# Altium project fpga_board.PrjPcb (part 1 of 2)
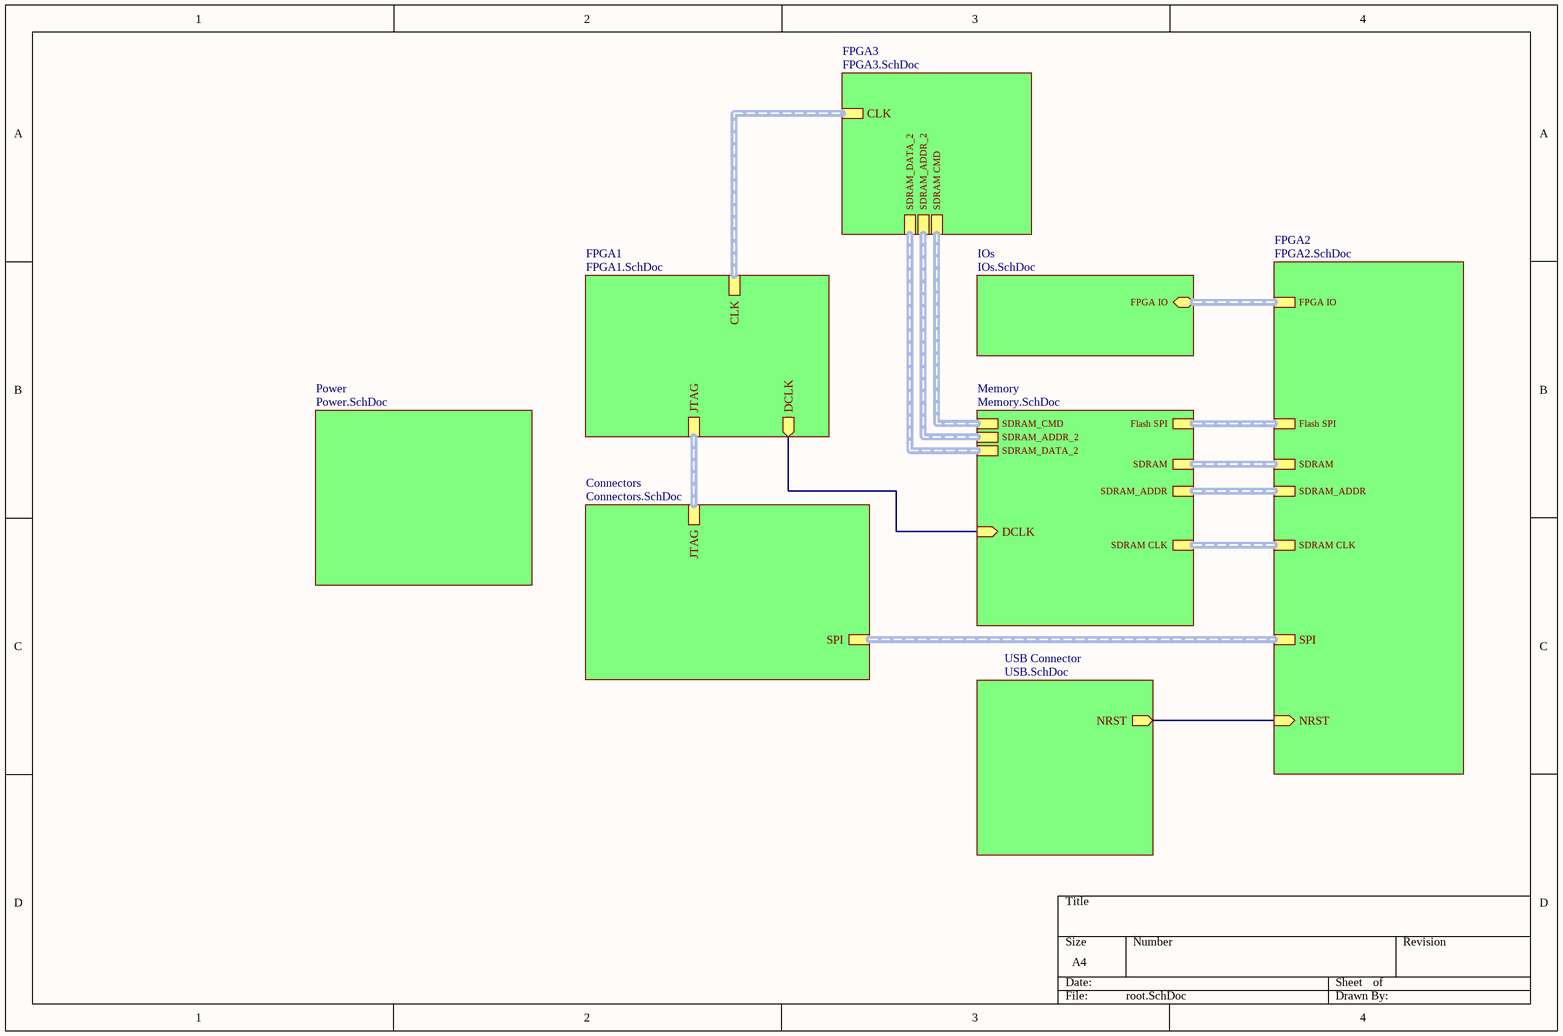
[diagram p0: root.SchDoc]
9 sheets, 192 parts. Net scope: hierarchical (ports join the sheet entries above them; power ports are global).
Board file: fpga_board.PcbDoc
Sheets:
  root.SchDoc
    FPGA1 = FPGA1.SchDoc
    IOs = IOs.SchDoc
    Memory = Memory.SchDoc
    Connectors = Connectors.SchDoc
    USB Connector = USB.SchDoc
    FPGA2 = FPGA2.SchDoc
    FPGA3 = FPGA3.SchDoc
    Power = Power.SchDoc

## Sheet root.SchDoc
size A4; SheetNumber: 1; SheetTotal: 9

### Sub-sheets
Connectors = Connectors.SchDoc: JTAG, SPI
FPGA1 = FPGA1.SchDoc: CLK, JTAG, DCLK (out)
FPGA2 = FPGA2.SchDoc: FPGA IO, Flash SPI, SDRAM, SDRAM_ADDR, SDRAM CLK, SPI, NRST (in)
FPGA3 = FPGA3.SchDoc: CLK, SDRAM CMD, SDRAM_ADDR_2, SDRAM_DATA_2
IOs = IOs.SchDoc: FPGA IO (bidir)
Memory = Memory.SchDoc: Flash SPI, SDRAM, SDRAM_ADDR, SDRAM_CMD, SDRAM CLK, DCLK (in), SDRAM_ADDR_2, SDRAM_DATA_2
Power = Power.SchDoc: no entries
USB Connector = USB.SchDoc: NRST (out)

### Nets
DCLK: sheet FPGA1/DCLK, sheet Memory/DCLK
(unnamed): sheet USB Connector/NRST, sheet FPGA2/NRST

### Buses and harness runs
harness sheet Connectors/JTAG = sheet FPGA1/JTAG
harness sheet Connectors/SPI = sheet FPGA2/SPI
harness sheet FPGA1/CLK = sheet FPGA3/CLK
harness sheet FPGA2/Flash SPI = sheet Memory/Flash SPI
harness sheet FPGA2/FPGA IO = sheet IOs/FPGA IO
harness sheet FPGA2/SDRAM = sheet Memory/SDRAM
harness sheet FPGA2/SDRAM CLK = sheet Memory/SDRAM CLK
harness sheet FPGA2/SDRAM_ADDR = sheet Memory/SDRAM_ADDR
harness sheet FPGA3/SDRAM CMD = sheet Memory/SDRAM_CMD
harness sheet FPGA3/SDRAM_ADDR_2 = sheet Memory/SDRAM_ADDR_2
harness sheet FPGA3/SDRAM_DATA_2 = sheet Memory/SDRAM_DATA_2

## Sheet FPGA1.SchDoc
size A4; SheetNumber: 2; SheetTotal: 9
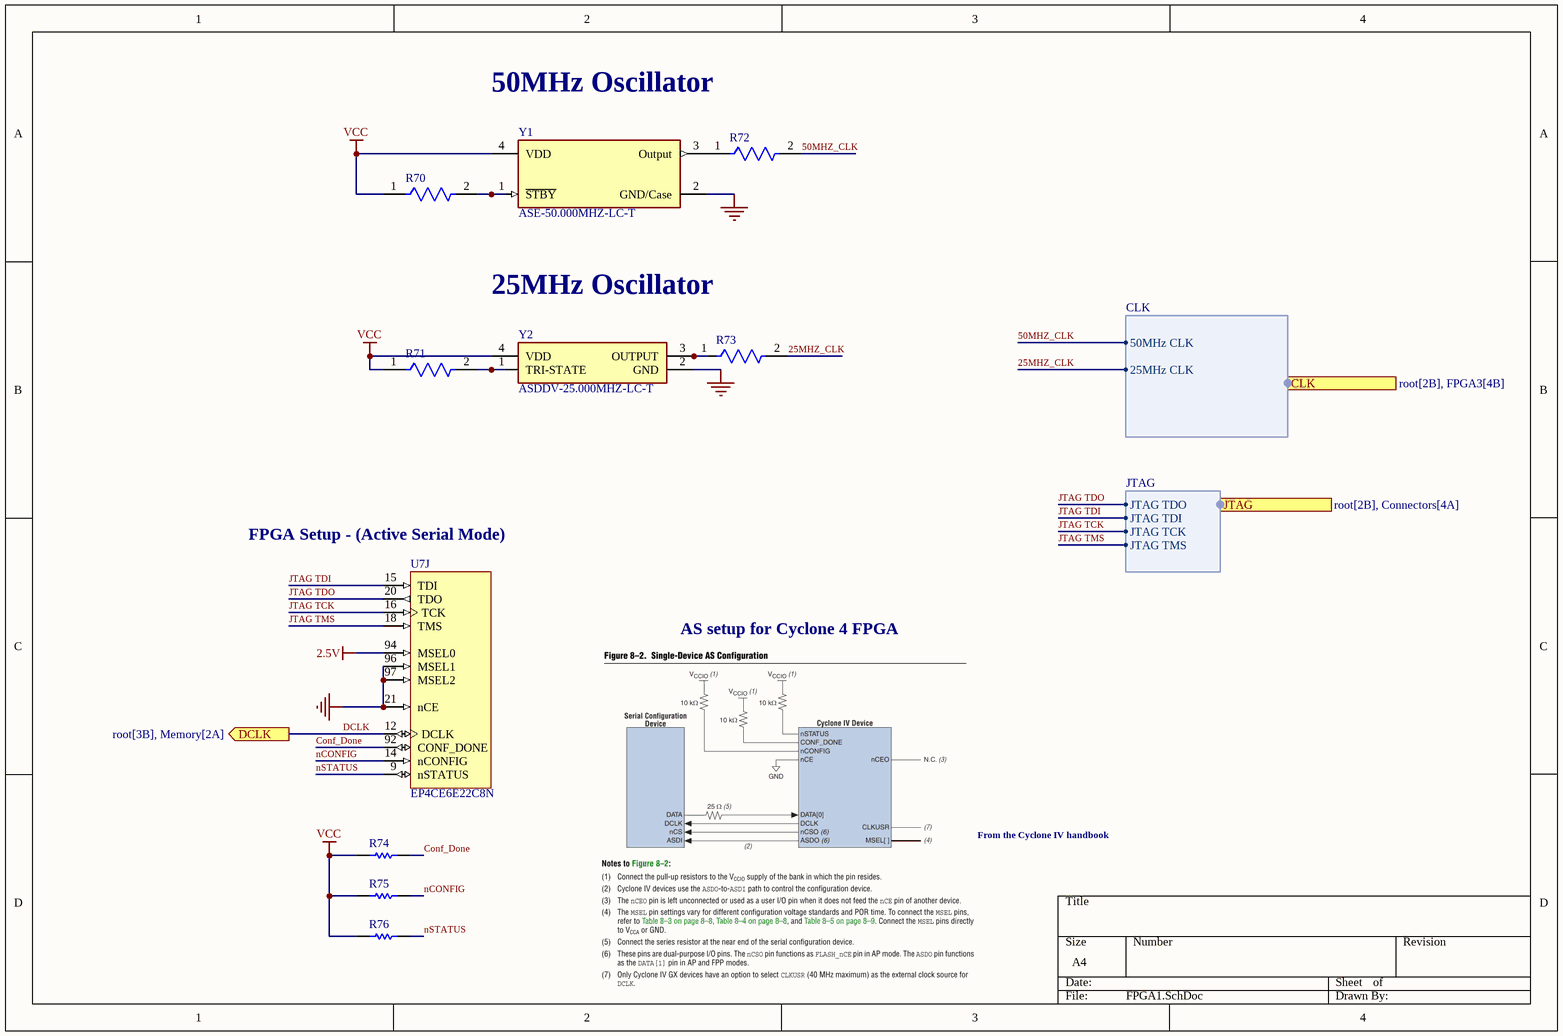
[diagram p1: FPGA1.SchDoc]

### Parts
R70  RC0603FR-073K3L  [FP-RC0603-0_55-MFG]  (value not drawn)
R71  RC0603FR-073K3L  [FP-RC0603-0_55-MFG]  (value not drawn)
R72  RT0402BRE0733RL  [FP-RT0402-MFG]  (value not drawn)
R73  RT0402BRE0733RL  [FP-RT0402-MFG]  (value not drawn)
R74  RC0402FR-0710KL  [RESC1005X40X25LL05T10]  (value not drawn)
R75  RC0402FR-0710KL  [RESC1005X40X25LL05T10]  (value not drawn)
R76  RC0402FR-0710KL  [RESC1005X40X25LL05T10]  (value not drawn)
U7  EP4CE6E22C8N  [EQFP144_A-165_D2-54_M]  (part J of 13)
Y1  ASE-50.000MHZ-LC-T  [FP-ASE-MFG]
Y2  ASDDV-25.000MHZ-LC-T  [AbraconASDDV]

### Ports
CLK (harness CLK, see root[2B], FPGA3[4B]), DCLK (out, see root[3B], Memory[2A]), JTAG (harness JTAG, see root[2B], Connectors[4A])

### Harnesses
CLK: 50MHz CLK, 25MHz CLK
JTAG: JTAG TDO, JTAG TDI, JTAG TCK, JTAG TMS

### Nets
2.5V: U7.94(MSEL0)
GND: U7.21(nCE) U7.96(MSEL1) U7.97(MSEL2) Y1.2(GND/Case) Y2.2(GND)
VCC: R70.1 R71.1 R74.1 R75.1 R76.1 Y1.4(VDD) Y2.4(VDD)
25MHZ_CLK: R73.2 ; port CLK.25MHz CLK  [project net 25MHz CLK]
50MHZ_CLK: R72.2 ; port CLK.50MHz CLK
Conf_Done: R74.2 U7.92(CONF_DONE)
DCLK: U7.12(DCLK) ; port DCLK
JTAG TCK: U7.16(TCK) ; port JTAG.JTAG TCK
JTAG TDI: U7.15(TDI) ; port JTAG.JTAG TDI
JTAG TDO: U7.20(TDO) ; port JTAG.JTAG TDO
JTAG TMS: U7.18(TMS) ; port JTAG.JTAG TMS
nCONFIG: R75.2 U7.14(nCONFIG)
nSTATUS: R76.2 U7.9(nSTATUS)
NetR70_2: R70.2 Y1.1(~{STBY})
NetR71_2: R71.2 Y2.1(TRI-STATE)
NetR72_1: R72.1 Y1.3(Output)
NetR73_1: R73.1 Y2.3(OUTPUT)

### Notes on the sheet
- 50MHz Oscillator
- 25MHz Oscillator
- (near U7) FPGA Setup - (Active Serial Mode)
- AS setup for Cyclone 4 FPGA
- From the Cyclone IV handbook

### Library data of the parts
R70 R71 = CMP-1012-00567-3: NexarPartId: 40011875; Tolerance: 1%; Power Rating: 100mW; Temperature Coefficient: 100ppm/°C; Voltage Rating (DC): 50V; Resistance: 3.3kΩ; Military Standard: Not; Case/Package: 0603; Mount: Surface Mount; Lead Free: Lead Free; Packaging: Tape & Reel; Termination: SMD/SMT; Number of Terminations: 2; Composition: Thick Film; Length: 1.6mm; Max Power Dissipation: 100mW; Width: 800µm; Features: Moisture Resistant; Max Operating Temperature: 155°C; Depth: 800µm; Number of Pins: 2; REACH SVHC: No SVHC; Case Code (Imperial): 0603; Case Code (Metric): 0603; RoHS: Compliant; Voltage Rating (AC): 50V; Voltage Rating: 50V; Schedule B: 8533210045, 8533210045; Min Operating Temperature: -55°C; Height: 450µm
R72 R73 = CMP-2002-02979-2: RES SMD 33 OHM 0.1% 1/16W 0402; Manufacturer: Yageo; Power Rating: 0.063W; Temperature Coefficient: 50 ppm/°C; Tolerance: 0.001; Resistance: 33Ω; Value: 33Ω; Voltage Rating: 50V; Lead Free: Yes; Temperature Range Low: -55°C; ComponentLink2Description: Datasheet; Device Class L2: Resistors; Footprint Url: http://www.yageo.com/exep/pages/download/literatures/PYu-R_Mount_10.pdf; Temperature: -55°C to +155°C; Automotive: No; Manufacturer Part Number: RT0402BRE0733RL; Series: RT; Device Class L3: Chip SMD Resistors; Height: 0.35mm; Digikey Description: RES SMD 33 OHM 0.1% 1/16W 0402; Octopart: https://octopart.com/rt0402bre0733rl-yageo-1202878; Package: RT0402; ComponentLink2URL: http://www.yageo.com/documents/recent/PYu-RT_1-to-0.01_RoHS_L_9.pdf; Composition: Thin Film; Category: Res; Ipc Land Pattern Name: RESC10050X30; Device Class L1: Passive Components; RoHS: TRUE; Temperature Range High: +155°C
R74-R76 = CMP-2002-07353-1: Manufacturer: Yageo / Phycomp; Part Number: RC0402FR-0710KL
U7 = CMP-0038-00212-1: Cyclone IV Family FPGA, 1.2V Core, 91 I/O Pins, 2 PLLs, 144-Pin QFP, Speed Grade 8, Commercial Grade, Pb-Free; Manufacturer: Altera; ComponentLink3Description: Pinout; ComponentLink4Description: Package Specification; DatasheetVersion: ver1.6, Nov-2011; ComponentLink1URL: http://www.altera.com/; ComponentLink2URL: http://www.altera.com/literature/hb/cyclone-iv/cyclone4-handbook.pdf; ComponentLink2Description: Handbook; PackageReference: EQFP144_A-165_D2-54; ComponentLink3URL: http://www.altera.com/literature/lit-dp.jsp?category=cyc%204&showspreadsheet=y; PackageVersion: ver1.0, Jan-2011; ComponentLink1Description: Manufacturer URL; ComponentLink4URL: http://www.altera.com/devicepackaging/04R00402-00.pdf; PackageDescription: 144-Pin Plastic Enhanced Quad Flat Pack (EQFP) - Wire Bond - A:1.65 - D2:5.4; Code_JEDEC: MS-026-BFB-HD
Y1 = CMP-27762-009764-1: XTAL Oscillator 50MHz ±50ppm CMOS 3.3V 4-SMD 3.2mm x 2.5mm; Load Capacitance: 15pF; Max Supply Current: 19mA; Min Supply Voltage: 3.135V; Max Supply Voltage: 3.465V; Packaging: Tape and Reel; Height: 0.047inch; Mount: Surface Mount; Frequency Stability: 50ppm; Lead Free: Lead Free; Number of Pins: 4; Width: 0.098inch; Radiation Hardening: No; Max Operating Temperature: 85°C; Length: 3.2mm; REACH SVHC: No SVHC; Series: ASE; Depth: 2.5mm; Operating Supply Voltage: 3.3V; Min Operating Temperature: -40°C; Package Quantity: 1000; Operating Frequency: 50 MHz; Case/Package: SMD/SMT; Termination: SMD/SMT; Frequency: 50MHz
Y2 = ASDDV-25.000MHZ-LC-T: Crystal or Oscillator; Manufacturer_Name: ABRACON; Datasheet Link: https://abracon.com/datasheets/ASDDV.pdf; Height: 0.95mm; Manufacturer_Part_Number: ASDDV-25.000MHZ-LC-T; Mouser Part Number: 815-ASDDV-2500MHZLCT; Mouser Price/Stock: https://www.mouser.co.uk/ProductDetail/ABRACON/ASDDV-25.000MHZ-LC-T?qs=GedFDFLaBXGr7Q4o6E2H1w%3D%3D; Arrow Part Number: ASDDV-25.000MHZ-LC-T; Arrow Price/Stock: https://www.arrow.com/en/products/asddv-25.000mhz-lc-t/abracon?region=nac

## Sheet IOs.SchDoc
size A4; SheetNumber: 3; SheetTotal: 9
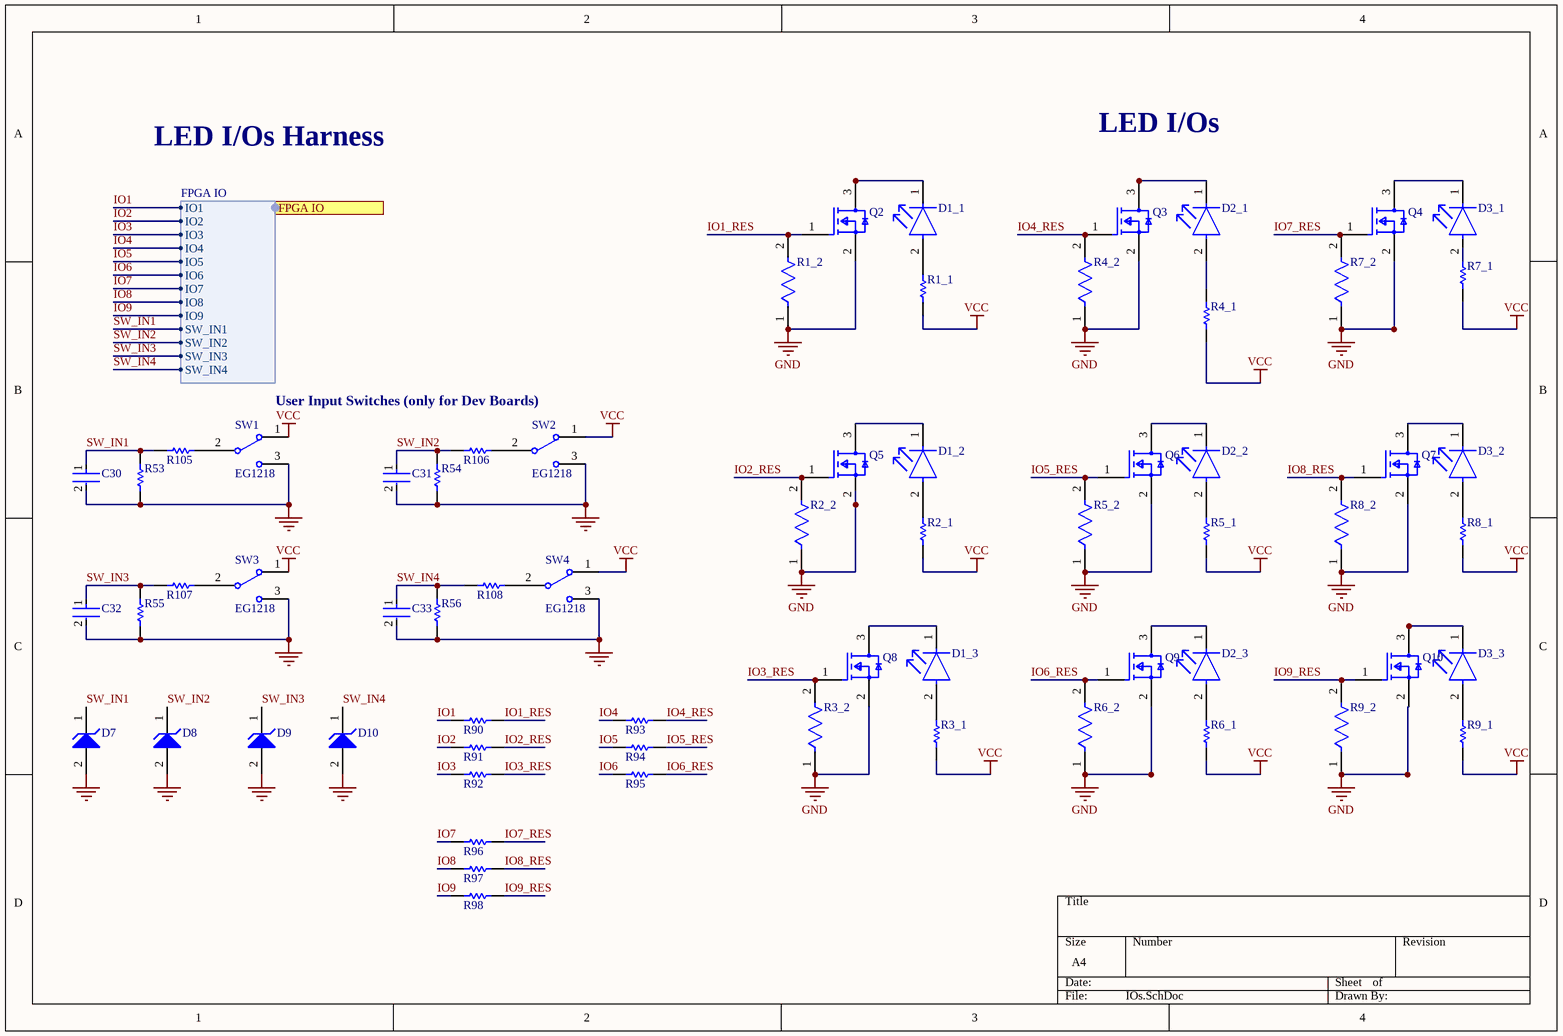
[diagram p2: IOs.SchDoc]

### Parts
C30  CC0402KRX7R9BB103  [FP-CC0402-MFG]  (value not drawn)
C31  CC0402KRX7R9BB103  [FP-CC0402-MFG]  (value not drawn)
C32  CC0402KRX7R9BB103  [FP-CC0402-MFG]  (value not drawn)
C33  CC0402KRX7R9BB103  [FP-CC0402-MFG]  (value not drawn)
D1_1  LTST-C230KRKT  [FP-LTST-C230KRKT-MFG]  (value not drawn)
D1_2  LTST-C230KRKT  [FP-LTST-C230KRKT-MFG]  (value not drawn)
D1_3  LTST-C230KRKT  [FP-LTST-C230KRKT-MFG]  (value not drawn)
D2_1  LTST-C230KRKT  [FP-LTST-C230KRKT-MFG]  (value not drawn)
D2_2  LTST-C230KRKT  [FP-LTST-C230KRKT-MFG]  (value not drawn)
D2_3  LTST-C230KRKT  [FP-LTST-C230KRKT-MFG]  (value not drawn)
D3_1  LTST-C230KRKT  [FP-LTST-C230KRKT-MFG]  (value not drawn)
D3_2  LTST-C230KRKT  [FP-LTST-C230KRKT-MFG]  (value not drawn)
D3_3  LTST-C230KRKT  [FP-LTST-C230KRKT-MFG]  (value not drawn)
D7  MM5Z3V3T1G  [ONSC-SOD-523-2-502-01_V]  (value not drawn)
D8  MM5Z3V3T1G  [ONSC-SOD-523-2-502-01_V]  (value not drawn)
D9  MM5Z3V3T1G  [ONSC-SOD-523-2-502-01_V]  (value not drawn)
D10  MM5Z3V3T1G  [ONSC-SOD-523-2-502-01_V]  (value not drawn)
Q2  MMBF170LT1G  [FP-318-08-IPC_B]  (value not drawn)
Q3  MMBF170LT1G  [FP-318-08-IPC_B]  (value not drawn)
Q4  MMBF170LT1G  [FP-318-08-IPC_B]  (value not drawn)
Q5  MMBF170LT1G  [FP-318-08-IPC_B]  (value not drawn)
Q6  MMBF170LT1G  [FP-318-08-IPC_B]  (value not drawn)
Q7  MMBF170LT1G  [FP-318-08-IPC_B]  (value not drawn)
Q8  MMBF170LT1G  [FP-318-08-IPC_B]  (value not drawn)
Q9  MMBF170LT1G  [FP-318-08-IPC_B]  (value not drawn)
Q10  MMBF170LT1G  [FP-318-08-IPC_B]  (value not drawn)
R1_1  RC0402FR-07330RL  [RESC1005X40X25LL05T10]  (value not drawn)
R1_2  RC0402JR-0710KL  [FP-RC0402-0_4-IPC_C]  (value not drawn)
R2_1  RC0402FR-07330RL  [RESC1005X40X25LL05T10]  (value not drawn)
R2_2  RC0402JR-0710KL  [FP-RC0402-0_4-IPC_C]  (value not drawn)
R3_1  RC0402FR-07330RL  [RESC1005X40X25LL05T10]  (value not drawn)
R3_2  RC0402JR-0710KL  [FP-RC0402-0_4-IPC_C]  (value not drawn)
R4_1  RC0402FR-07330RL  [RESC1005X40X25LL05T10]  (value not drawn)
R4_2  RC0402JR-0710KL  [FP-RC0402-0_4-IPC_C]  (value not drawn)
R5_1  RC0402FR-07330RL  [RESC1005X40X25LL05T10]  (value not drawn)
R5_2  RC0402JR-0710KL  [FP-RC0402-0_4-IPC_C]  (value not drawn)
R6_1  RC0402FR-07330RL  [RESC1005X40X25LL05T10]  (value not drawn)
R6_2  RC0402JR-0710KL  [FP-RC0402-0_4-IPC_C]  (value not drawn)
R7_1  RC0402FR-07330RL  [RESC1005X40X25LL05T10]  (value not drawn)
R7_2  RC0402JR-0710KL  [FP-RC0402-0_4-IPC_C]  (value not drawn)
R8_1  RC0402FR-07330RL  [RESC1005X40X25LL05T10]  (value not drawn)
R8_2  RC0402JR-0710KL  [FP-RC0402-0_4-IPC_C]  (value not drawn)
R9_1  RC0402FR-07330RL  [RESC1005X40X25LL05T10]  (value not drawn)
R9_2  RC0402JR-0710KL  [FP-RC0402-0_4-IPC_C]  (value not drawn)
R53  3K3 5% 0603(1608)  [RESC0603(1608)_N]  (value not drawn)
R54  3K3 5% 0603(1608)  [RESC0603(1608)_N]  (value not drawn)
R55  3K3 5% 0603(1608)  [RESC0603(1608)_N]  (value not drawn)
R56  3K3 5% 0603(1608)  [RESC0603(1608)_N]  (value not drawn)
R90  RC0402FR-07330RL  [RESC1005X40X25LL05T10]  (value not drawn)
R91  RC0402FR-07330RL  [RESC1005X40X25LL05T10]  (value not drawn)
R92  RC0402FR-07330RL  [RESC1005X40X25LL05T10]  (value not drawn)
R93  RC0402FR-07330RL  [RESC1005X40X25LL05T10]  (value not drawn)
R94  RC0402FR-07330RL  [RESC1005X40X25LL05T10]  (value not drawn)
R95  RC0402FR-07330RL  [RESC1005X40X25LL05T10]  (value not drawn)
R96  RC0402FR-07330RL  [RESC1005X40X25LL05T10]  (value not drawn)
R97  RC0402FR-07330RL  [RESC1005X40X25LL05T10]  (value not drawn)
R98  RC0402FR-07330RL  [RESC1005X40X25LL05T10]  (value not drawn)
R105  RC0402FR-07330RL  [RESC1005X40X25LL05T10]  (value not drawn)
R106  RC0402FR-07330RL  [RESC1005X40X25LL05T10]  (value not drawn)
R107  RC0402FR-07330RL  [RESC1005X40X25LL05T10]  (value not drawn)
R108  RC0402FR-07330RL  [RESC1005X40X25LL05T10]  (value not drawn)
SW1  EG1218  [ESWI-EG1218_V]
SW2  EG1218  [ESWI-EG1218_V]
SW3  EG1218  [ESWI-EG1218_V]
SW4  EG1218  [ESWI-EG1218_V]

### Ports
FPGA IO (harness FPGA IO, see root[4B], FPGA2[3A])

### Harnesses
FPGA IO: IO1, IO2, IO3, IO4, IO5, IO6, IO7, IO8, IO9, SW_IN1, SW_IN2, SW_IN3, SW_IN4

### Nets
GND: C30.2 C31.2 C32.2 C33.2 D7.2(A) D8.2(A) D9.2(A) D10.2(A) Q2.2(S) Q3.2(S) Q4.2(S) Q5.2(S) Q6.2(S) Q7.2(S) Q8.2(S) Q9.2(S) Q10.2(S) R1_2.1 R2_2.1 R3_2.1 R4_2.1 R5_2.1 R6_2.1 R7_2.1 R8_2.1 R9_2.1 R53.1 R54.1 R55.1 R56.1 SW1.3 SW2.3 SW3.3 SW4.3
VCC: R1_1.1 R2_1.1 R3_1.1 R4_1.1 R5_1.1 R6_1.1 R7_1.1 R8_1.1 R9_1.1 SW1.1 SW2.1 SW3.1 SW4.1
IO1: R90.2 ; port FPGA IO.IO1
IO1_RES: Q2.1(G) R1_2.2 R90.1
IO2: R91.2 ; port FPGA IO.IO2
IO2_RES: Q5.1(G) R2_2.2 R91.1
IO3: R92.2 ; port FPGA IO.IO3
IO3_RES: Q8.1(G) R3_2.2 R92.1
IO4: R93.2 ; port FPGA IO.IO4
IO4_RES: Q3.1(G) R4_2.2 R93.1
IO5: R94.2 ; port FPGA IO.IO5
IO5_RES: Q6.1(G) R5_2.2 R94.1
IO6: R95.2 ; port FPGA IO.IO6
IO6_RES: Q9.1(G) R6_2.2 R95.1
IO7: R96.2 ; port FPGA IO.IO7
IO7_RES: Q4.1(G) R7_2.2 R96.1
IO8: R97.2 ; port FPGA IO.IO8
IO8_RES: Q7.1(G) R8_2.2 R97.1
IO9: R98.2 ; port FPGA IO.IO9
IO9_RES: Q10.1(G) R9_2.2 R98.1
SW_IN1: C30.1 D7.1(K) R53.2 R105.2 ; port FPGA IO.SW_IN1
SW_IN2: C31.1 D8.1(K) R54.2 R106.2 ; port FPGA IO.SW_IN2
SW_IN3: C32.1 D9.1(K) R55.2 R107.2 ; port FPGA IO.SW_IN3
SW_IN4: C33.1 D10.1(K) R56.2 R108.2 ; port FPGA IO.SW_IN4
NetD1_1_1: D1_1.1(C) Q2.3(D)
NetD1_1_2: D1_1.2(A) R1_1.2
NetD1_2_1: D1_2.1(C) Q5.3(D)
NetD1_2_2: D1_2.2(A) R2_1.2
NetD1_3_1: D1_3.1(C) Q8.3(D)
NetD1_3_2: D1_3.2(A) R3_1.2
NetD2_1_1: D2_1.1(C) Q3.3(D)
NetD2_1_2: D2_1.2(A) R4_1.2
NetD2_2_1: D2_2.1(C) Q6.3(D)
NetD2_2_2: D2_2.2(A) R5_1.2
NetD2_3_1: D2_3.1(C) Q9.3(D)
NetD2_3_2: D2_3.2(A) R6_1.2
NetD3_1_1: D3_1.1(C) Q4.3(D)
NetD3_1_2: D3_1.2(A) R7_1.2
NetD3_2_1: D3_2.1(C) Q7.3(D)
NetD3_2_2: D3_2.2(A) R8_1.2
NetD3_3_1: D3_3.1(C) Q10.3(D)
NetD3_3_2: D3_3.2(A) R9_1.2
NetR105_1: R105.1 SW1.2(COM)
NetR106_1: R106.1 SW2.2(COM)
NetR107_1: R107.1 SW3.2(COM)
NetR108_1: R108.1 SW4.2(COM)

### Notes on the sheet
- LED I/Os Harness
- LED I/Os
- User Input Switches (only for Dev Boards)

### Library data of the parts
C30-C33 = CMP-2100-03592-2: CAP CER 10000PF 50V X7R 0402; Manufacturer: YAGEO; Temperature Coefficient: 30ppm/°C; Capacitance: 10 nF; Material: Ceramic; Automotive Grade: NA; Tolerance: 0.1; Value: 10 nF; Device Class L3: Ceramic Capacitors; Temperature: -55°C to +125°C; Footprint Url: http://www.yageo.com/exep/pages/download/literatures/UPY-C_GEN_24.pdf; Ipc Land Pattern Name: CAPC10050X50; Device Class L1: Passive Components; Automotive: No; Octopart: https://octopart.com/cc0402krx7r9bb103-yageo-8376513; Manufacturer Part Number: CC0402KRX7R9BB103; Lead Free: Yes; Temperature Range Low: -55°C; Height: 0.55mm; ComponentLink2URL: http://www.yageo.com/documents/recent/UPY-GP_NP0_16V-to-50V_16.pdf; Category: Cap; ComponentLink2Description: Datasheet; Temperature Range High: +125°C; Digikey Description: CAP CER 10000PF 50V X7R 0402; Voltage Rating: 50 V; Package: CC0402; Device Class L2: Capacitors; Mouser Description: 0402 10 nF 50 V ±10 % Tolerance X7R SMT Multilayer Ceramic Capacitor; RoHS: TRUE; Temperature Characteristic: X7R
D1_1-D1_3 D2_1-D2_3 D3_1-D3_3 = CMP-22017-000041-1: LED RED CLEAR CHIP SMD; Dominant Wavelength: 631nm; Lens Color: Colorless; Lens Style: Diffused; Forward Voltage: 2V; Test Current: 20mA; Luminous Intensity: 54mcd; Number of LEDs: 1; Viewing Angle: 130°; Power Rating: 75mW; Forward Current: 30mA; Wavelength: 639nm; Reverse Voltage: 5V; Min Operating Temperature: -55°C; Height: 1.1mm; Length: 3.2mm; Lens Transparency: Clear; Case/Package: 1206; Package Quantity: 1; Width: 1.6mm; Max Operating Temperature: 85°C; Packaging: Tape and Reel; RoHS Compliant: Yes; Mount: Surface Mount; Lead Free: Lead Free; Depth: 1.6mm; Power Dissipation: 75mW; Number of Pins: 2; Number of Elements: 1; Color: Red; Illumination Color: Red; Case Code (Imperial): 1206; Case Code (Metric): 3216; Radiation Hardening: No
D7-D10 = CMP-1060-00750-1: Zener Voltage Regulator, 500 mW, 2-Pin SOD-523, Pb-Free, Tape and Reel; Manufacturer: On Semiconductor; P Max (W): 0.5; VZ Typ (V): 3.3; RoHS: Pb-Free; ComponentLink2Description: Datasheet; PackageReference: SOD-523-2-502-01; DatasheetVersion: Rev. 10; ComponentLink1Description: Manufacturer URL; PackageVersion: Rev. E, 09/2010; ComponentLink3URL: http://www.onsemi.com/pub_link/Collateral/502-01.PDF; ComponentLink2URL: http://www.onsemi.cn/pub_link/Collateral/MM5Z2V4T1-D.PDF; Mounting Technology: Surface Mount; PartNumber: MM5Z3V3T1G; Packing: Tape and Reel; PackageDescription: 2-Pin SOD, Body 1.2 x 0.8 mm; ComponentLink1URL: http://www.onsemi.com/; ComponentLink3Description: Package Specification
Q2-Q10 = CMP-1058-00793-2: MOSFET N-CH 60V 500MA SOT-23; Polarization: N; Rds On Max: 5R; Power Dissipation: 225mW; Number of Elements: 1; Element Configuration: Single; Input Capacitance: 60pF; Threshold Voltage: 3V; Polarity: N-CHANNEL; Gate to Source Voltage (Vgs): 20V; Turn-Off Delay Time: 10ns; Drain to Source Breakdown Voltage: 60V; On-State Resistance: 5R; Width: 1.3mm; Voltage Rating (DC): 60V; Package Quantity: 3000; Max Operating Temperature: 150°C; Drain to Source Resistance: 5R; Drain-source On Resistance-Max: 5R; Packaging: Tape and Reel; REACH SVHC: No SVHC; Case/Package: SOT-23-3; Number of Pins: 3; RoHS Compliant: Yes; Radiation Hardening: No; Min Operating Temperature: -55°C; Continuous Drain Current (ID): 500mA; Lead Free: Lead Free; Height: 0.94mm; Current Rating: 500mA; Turn-On Delay Time: 10ns; Series: -; Max Power Dissipation: 225mW; Length: 2.9mm; Nominal Vgs: 3V
R1_1 R2_1 R3_1 R4_1 R5_1 R6_1 R7_1 R8_1 R9_1 R90-R98 R105-R108 = CMP-2002-07613-1: Manufacturer: Yageo / Phycomp; Part Number: RC0402FR-07330RL
R1_2 R2_2 R3_2 R4_2 R5_2 R6_2 R7_2 R8_2 R9_2 = CMP-2002-07915-3: RES 10K OHM 5% 1/16W 0402; Max Power Dissipation: 63mW; Temperature Coefficient: 100ppm/°C; Power Rating: 62.5mW; Resistance: 10kR; Voltage Rating: 50V; Size Code: 0402; Resistance Tolerance: 5%; Packaging: Tape and Reel; Case Code (Metric): 1005; Lead Free: Lead Free; Resistor Type: Thick Film; Min Operating Temperature: -55°C; Military Standard: Not; Depth: 0.5mm; Series: RC; Case/Package: 0402; Construction: Rectangular; Number of Terminations: 2; Package Quantity: 1; Termination: SMD/SMT; Length: 0.039inch; Case Code (Imperial): 0402; Height: 0.016inch; Features: Moisture Resistant; RoHS Compliant: Yes; Max Operating Temperature: 155°C; Tolerance: 5%; Width: 0.02inch
R53-R56 = CMP-1012-00086-1: 3K3 0.1W 5% 0603 (1608 Metric)  SMD; Case-EIA: 0603; Value: 3300.00 Ohm; Case-Metric: 1608; Technology: SMT; Tolerance: 5 %; Power: 0.1 W
SW1-SW4 = CMP-1696-00002-1: Slide Switch, 500 V, -20 to 70 degC, 3-Pin THD, RoHS; Case\Package: SOT-23-5; Output Current: 150 mA; Nominal Output Voltage: 3.3 V; Max Power Dissipation: 250 mW; Min Input Voltage: 4.3 V; Outputs: 1; Max Input Voltage: 8 V; Dropout Voltage: 300 mV; PackageDescription: 3-Pin Through Hole Device, Body 11.6 x 4 mm, Pitch 2.5 mm; ComponentLink1URL: http://www.e-switch.ch/en/; RoHSCompliant: true; Length: 3 mm; ComponentLink1Description: Manufacturer URL; Power Rating: 250 mW; Mount: Surface Mount; Max Operating Temperature: 85 degC; REACH SVHC: No SVHC; Radiation Hardening: No; Height: 1.3 mm; Pins: 5; Max Ouput Current: 150 mA; Output Voltage: 3.3 V; Width: 1.8 mm; Package Quantity: 3000; ComponentLink2URL: https://www.e-switch.com/system/asset/product_line/data_sheet/119/EG.pdf; Min Operating Temperature: -40 degC; ComponentLink2Description: Datasheet; DatasheetVersion: Oct-15; PackageReference: EG1218; Packaging: Tape and Reel

## Sheet Memory.SchDoc
size A4; SheetNumber: 5; SheetTotal: 9
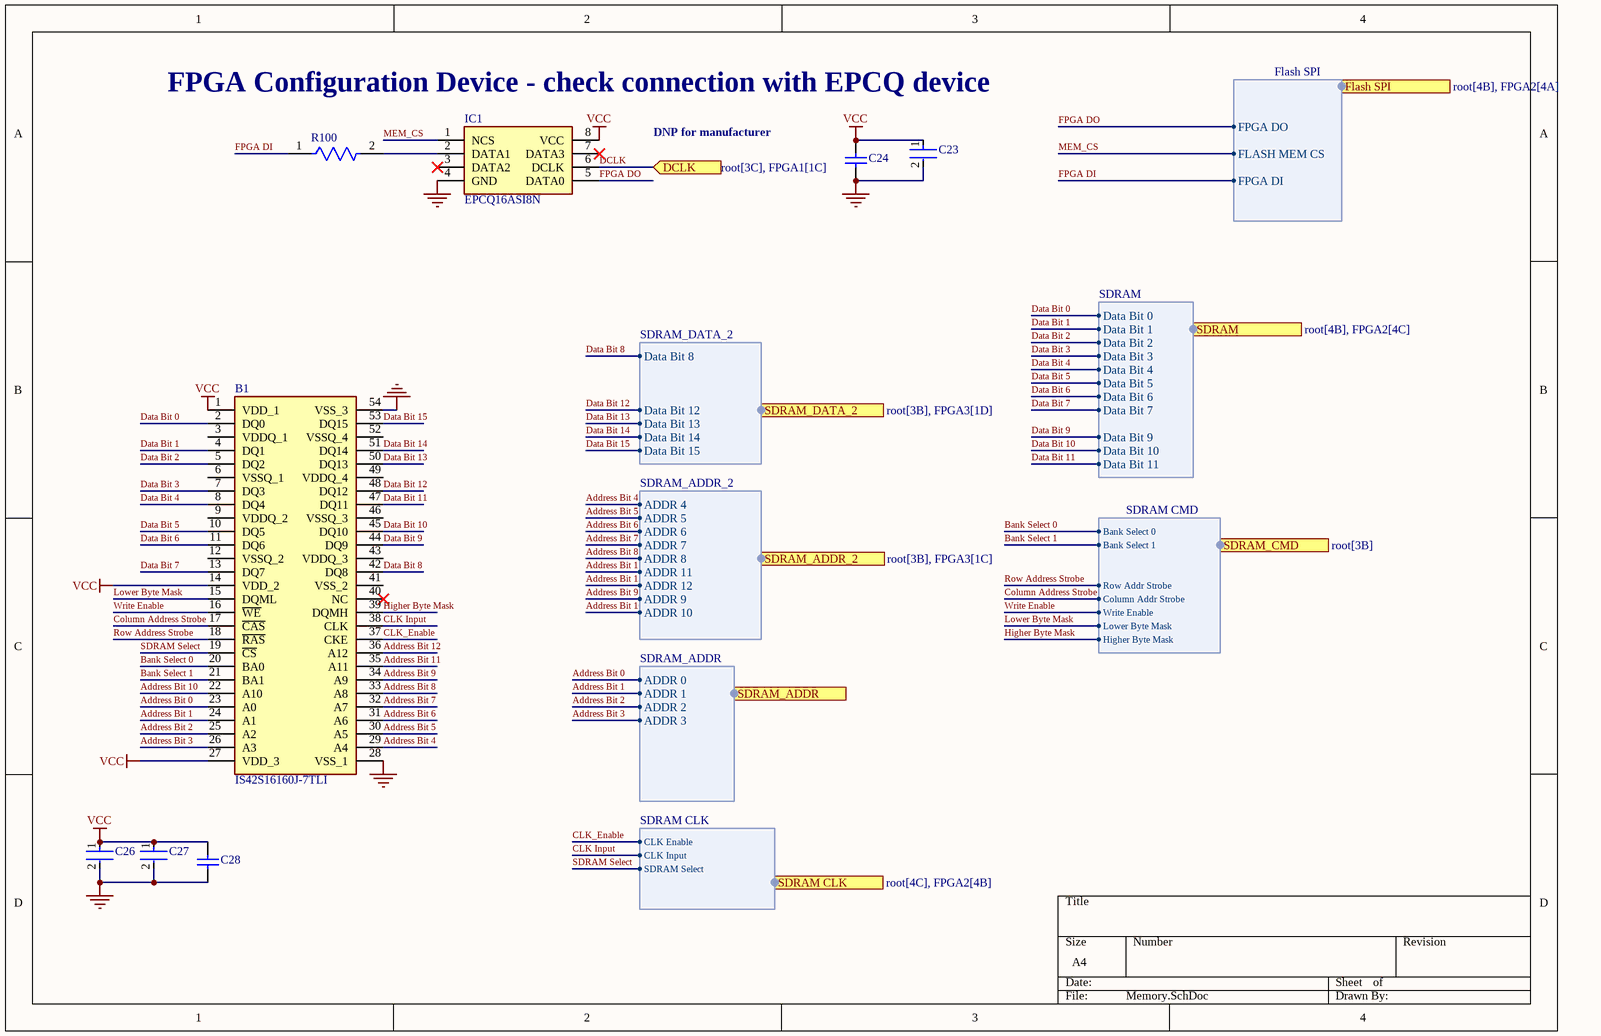
[diagram p3: Memory.SchDoc]

### Parts
B1  IS42S16160J-7TLI  [SOP80P1176X120-54N]
C23  CC0402KRX7R7BB104  [FP-CC0402-MFG]  (value not drawn)
C24  C0603C105K9PACTU  [CAPC1608X90X35LL15T15]  (value not drawn)
C26  CC0603KRX7R9BB104  [FP-CC0603-DA-MFG]  (value not drawn)
C27  CL21A475KAQNNNE  [FP-CL21-IPC_A]  (value not drawn)
C28  C0603C105K9PACTU  [CAPC1608X90X35LL15T15]  (value not drawn)
IC1  EPCQ16ASI8N  [SOIC127P600X175-8N]
R100  RC0402JR-0722RL  [FP-RC0402-0_4-IPC_B]  (value not drawn)

### Ports
DCLK (in, see root[3C], FPGA1[1C]), Flash SPI (harness Flash SPI, see root[4B], FPGA2[4A]), SDRAM (harness SDRAM, see root[4B], FPGA2[4C]), SDRAM CLK (harness SDRAM CLK, see root[4C], FPGA2[4B]), SDRAM_ADDR (harness SDRAM_ADDR, see root[4B], FPGA2[4C]), SDRAM_ADDR_2 (harness SDRAM_ADDR_2, see root[3B], FPGA3[1C]), SDRAM_CMD (harness SDRAM CMD, see root[3B]), SDRAM_DATA_2 (harness SDRAM_DATA_2, see root[3B], FPGA3[1D])

### Harnesses
Flash SPI: FPGA DO, FLASH MEM CS, FPGA DI
SDRAM: Data Bit 0, Data Bit 1, Data Bit 2, Data Bit 3, Data Bit 4, Data Bit 5, Data Bit 6, Data Bit 7, Data Bit 9, Data Bit 10, Data Bit 11
SDRAM_ADDR: ADDR 0, ADDR 1, ADDR 2, ADDR 3
SDRAM CMD: Bank Select 0, Bank Select 1, Row Addr Strobe, Column Addr Strobe, Write Enable, Lower Byte Mask, Higher Byte Mask
SDRAM CLK: CLK Enable, CLK Input, SDRAM Select
SDRAM_ADDR_2: ADDR 4, ADDR 5, ADDR 6, ADDR 7, ADDR 8, ADDR 11, ADDR 12, ADDR 9, ADDR 10
SDRAM_DATA_2: Data Bit 12, Data Bit 13, Data Bit 14, Data Bit 15, Data Bit 8

### Nets
GND: B1.28(VSS_1) B1.54(VSS_3) C23.2 C24.1 C26.2 C27.2 C28.1 IC1.4(GND)
VCC: B1.1(VDD_1) B1.14(VDD_2) B1.27(VDD_3) C23.1 C24.2 C26.1 C27.1 C28.2 IC1.8(VCC)
Address Bit 0: B1.23(A0) ; port SDRAM_ADDR.ADDR 0  [project net Addr Bit 0]
Address Bit 1: B1.24(A1) ; port SDRAM_ADDR.ADDR 1  [project net Addr Bit 1]
Address Bit 2: B1.25(A2) ; port SDRAM_ADDR.ADDR 2  [project net Addr Bit 2]
Address Bit 3: B1.26(A3) ; port SDRAM_ADDR.ADDR 3  [project net Addr Bit 3]
Address Bit 4: B1.29(A4) ; port SDRAM_ADDR_2.ADDR 4
Address Bit 5: B1.30(A5) ; port SDRAM_ADDR_2.ADDR 5
Address Bit 6: B1.31(A6) ; port SDRAM_ADDR_2.ADDR 6
Address Bit 7: B1.32(A7) ; port SDRAM_ADDR_2.ADDR 7
Address Bit 8: B1.33(A8) ; port SDRAM_ADDR_2.ADDR 8
Address Bit 9: B1.34(A9) ; port SDRAM_ADDR_2.ADDR 9  [project net Addr Bit 9]
Address Bit 10: B1.22(A10) ; port SDRAM_ADDR_2.ADDR 10  [project net Addr Bit 10]
Address Bit 11: B1.35(A11) ; port SDRAM_ADDR_2.ADDR 11  [project net Addr Bit 11]
Address Bit 12: B1.36(A12) ; port SDRAM_ADDR_2.ADDR 12  [project net Addr Bit 12]
Bank Select 0: B1.20(BA0) ; port SDRAM_CMD.Bank Select 0
Bank Select 1: B1.21(BA1) ; port SDRAM_CMD.Bank Select 1
CLK Input: B1.38(CLK) ; port SDRAM CLK.CLK Input
CLK_Enable: B1.37(CKE) ; port SDRAM CLK.CLK Enable
Column Address Strobe: B1.17(~{CAS}) ; port SDRAM_CMD.Column Addr Strobe
Data Bit 0: B1.2(DQ0) ; port SDRAM.Data Bit 0
Data Bit 1: B1.4(DQ1) ; port SDRAM.Data Bit 1
Data Bit 2: B1.5(DQ2) ; port SDRAM.Data Bit 2
Data Bit 3: B1.7(DQ3) ; port SDRAM.Data Bit 3
Data Bit 4: B1.8(DQ4) ; port SDRAM.Data Bit 4
Data Bit 5: B1.10(DQ5) ; port SDRAM.Data Bit 5
Data Bit 6: B1.11(DQ6) ; port SDRAM.Data Bit 6
Data Bit 7: B1.13(DQ7) ; port SDRAM.Data Bit 7
Data Bit 8: B1.42(DQ8) ; port SDRAM_DATA_2.Data Bit 8
Data Bit 9: B1.44(DQ9) ; port SDRAM.Data Bit 9
Data Bit 10: B1.45(DQ10) ; port SDRAM.Data Bit 10
Data Bit 11: B1.47(DQ11) ; port SDRAM.Data Bit 11
Data Bit 12: B1.48(DQ12) ; port SDRAM_DATA_2.Data Bit 12
Data Bit 13: B1.50(DQ13) ; port SDRAM_DATA_2.Data Bit 13
Data Bit 14: B1.51(DQ14) ; port SDRAM_DATA_2.Data Bit 14
Data Bit 15: B1.53(DQ15) ; port SDRAM_DATA_2.Data Bit 15
DCLK: IC1.6(DCLK) ; port DCLK
FPGA DI: R100.1 ; port Flash SPI.FPGA DI
FPGA DO: IC1.5(DATA0) ; port Flash SPI.FPGA DO
Higher Byte Mask: B1.39(DQMH) ; port SDRAM_CMD.Higher Byte Mask
Lower Byte Mask: B1.15(DQML) ; port SDRAM_CMD.Lower Byte Mask
MEM_CS: IC1.1(NCS) ; port Flash SPI.FLASH MEM CS
Row Address Strobe: B1.18(~{RAS}) ; port SDRAM_CMD.Row Addr Strobe
SDRAM Select: B1.19(~{CS}) ; port SDRAM CLK.SDRAM Select
Write Enable: B1.16(~{WE}) ; port SDRAM_CMD.Write Enable
NetIC1_2: IC1.2(DATA1) R100.2

Not connected (* = marked no-connect by the designer): B1 3(VDDQ_1) 6(VSSQ_1) 9(VDDQ_2) 12(VSSQ_2) 40(NC)* 41(VSS_2) 43(VDDQ_3) 46(VSSQ_3) 49(VDDQ_4) 52(VSSQ_4); IC1 3(DATA2)* 7(DATA3)*

### Notes on the sheet
- FPGA Configuration Device - check connection with EPCQ device
- DNP for manufacturer

### Library data of the parts
B1 = CMP-007-000000-1: DRAM 256M, 3.3V, SDRAM 16Mx16 143MHz; Manufacturer_Name: Integrated Silicon Solution Inc.; Geometry.Height: 1.2mm; Mouser Part Number: 870-IS42S16160J-7TLI; Mouser Price/Stock: https://www.mouser.co.uk/ProductDetail/ISSI/IS42S16160J-7TLI?qs=uCnMRCNammmen%252BmWnq1g5A%3D%3D; Source: IS42S16160J-7TLI.SchLib; Datasheet Link: http://www.issi.com/WW/pdf/42-45S83200J-16160J.pdf; Manufacturer_Part_Number: IS42S16160J-7TLI; Design Item ID: IS42S16160J-7TLI
C23 = CMP-03422-000048-1: CAP CER 0.1UF 16V X7R 0402; Manufacturer: YAGEO; Material: Ceramic; Automotive Grade: NA; Capacitance: 100 nF; Temperature Coefficient: 30ppm/°C; Tolerance: 0.1; Value: 100 nF; Device Class L1: Passive Components; Temperature Range Low: -55°C; Device Class L3: Ceramic Capacitors; Temperature Characteristic: X7R; Ipc Land Pattern Name: CAPC10050X50; Temperature Range High: +125°C; Voltage Rating: 16 V; Temperature: -55°C to +125°C; RoHS: TRUE; Automotive: No; Height: 0.55mm; Device Class L2: Capacitors; Digikey Description: CAP CER 0.1UF 16V X7R 0402; Package: CC0402; Footprint Url: http://www.yageo.com/exep/pages/download/literatures/UPY-C_GEN_24.pdf; ComponentLink2Description: Datasheet; Category: Cap; Lead Free: Yes; Octopart: https://octopart.com/cc0402krx7r7bb104-yageo-42244624; ComponentLink2URL: http://www.yageo.com/documents/recent/UPY-GP_NP0_16V-to-50V_16.pdf; Manufacturer Part Number: CC0402KRX7R7BB104; Mouser Description: 0402 0.1 uF 16 V ±10 % Tolerance X7R SMT Multilayer Ceramic Capacitor
C24 C28 = CMP-2006-02241-1: Manufacturer: Kemet; Part Number: C0603C105K9PACTU
C26 = CMP-2100-03601-2: CAP CER 0.1UF 50V X7R 0603; Manufacturer: YAGEO; Material: Ceramic; Capacitance: 100 nF; Temperature Coefficient: 15%; Tolerance: 0.1; Value: 100 nF; Height: 0.9mm; Voltage: 50 V; ComponentLink2Description: Datasheet; Device Class L2: Capacitors; Temperature Range High: +125°C; Category: Cap; Footprint Url: http://www.yageo.com/exep/pages/download/literatures/UPY-C_GEN_24.pdf; ComponentLink2URL: http://www.yageo.com/documents/recent/UPY-GPHC_X7R_6.3V-to-50V_18.pdf; Package: CC0603-DA; Temperature: -55°C to +125°C; Voltage Rating: 50 V; Temperature Characteristic: X7R; Device Class L1: Passive Components; Temperature Range Low: -55°C; Manufacturer Part Number: CC0603KRX7R9BB104; RoHS: TRUE; Automotive: No; Device Class L3: Ceramic Capacitors; Octopart: https://octopart.com/cc0603krx7r9bb104-yageo-42244635; Mouser Description: Multilayer Ceramic Capacitor, CC Series, 0.1 - F, - 10%, X7R, 50 V, 0603 [1608 Metric]; Lead Free: Yes; Digikey Description: CAP CER 0.1UF 50V X7R 0603
C27 = CMP-13271-002624-1: CL21 Series 0805 4.7uF 25V ±10% Tolerance X5R Multilayer Ceramic Chip Capacitor; Case Code (Imperial): 0805; Thickness: 0.055inch; Mount: Surface Mount; Case Code (Metric): 2012; Capacitance: 4.7uF; Depth: 1.25mm; Lead Free: Lead Free; Case/Package: 0805; Voltage Rating: 25V; Package Quantity: 1; Width: 0.049inch; Radiation Hardening: No; Voltage Rating (DC): 25V; Length: 2mm; Dielectric: X5R; Height: 1.25mm; Packaging: Tape and Reel; Tolerance: 10%; Min Operating Temperature: -55°C; Max Operating Temperature: 85°C
IC1 = EPCQ16ASI8N: Integrated Circuit; Manufacturer_Name: Intel; Datasheet Link: https://www.altera.com/content/dam/altera-www/global/en_US/pdfs/literature/hb/cfg/cfg_cf52014.pdf; Height: 1.75mm; Manufacturer_Part_Number: EPCQ16ASI8N; Mouser Part Number: 989-EPCQ16ASI8N; Mouser Price/Stock: https://www.mouser.co.uk/ProductDetail/Altera/EPCQ16ASI8N?qs=EU6FO9ffTwfG9ViUTMZ%252BJw%3D%3D; Arrow Part Number: EPCQ16ASI8N; Arrow Price/Stock: https://www.arrow.com/en/products/epcq16asi8n/altera?utm_currency=USD&region=nac
R100 = CMP-2002-07961-2: RES SMD 22 OHM 5% 1/16W 0402; Max Power Dissipation: 63mW; Power Rating: 62.5mW; Resistance: 22R; Voltage Rating: 50V; Temperature Coefficient: 100ppm/°C; Termination: SMD/SMT; Length: 0.039inch; Construction: Rectangular; Case Code (Metric): 1005; RoHS Compliant: Yes; Width: 0.02inch; Resistance Tolerance: 5%; Size Code: 0402; Military Standard: Not; Max Operating Temperature: 155°C; REACH SVHC: No SVHC; Lead Free: Lead Free; Number of Terminations: 2; Depth: 0.5mm; Height: 0.016inch; Tolerance: 5%; Min Operating Temperature: -55°C; Resistor Type: Thick Film; Series: RC; Case Code (Imperial): 0402; Features: Moisture Resistant; Packaging: Tape and Reel; Case/Package: 0402; Package Quantity: 1

## Sheet Connectors.SchDoc
size A4; SheetNumber: 6; SheetTotal: 9
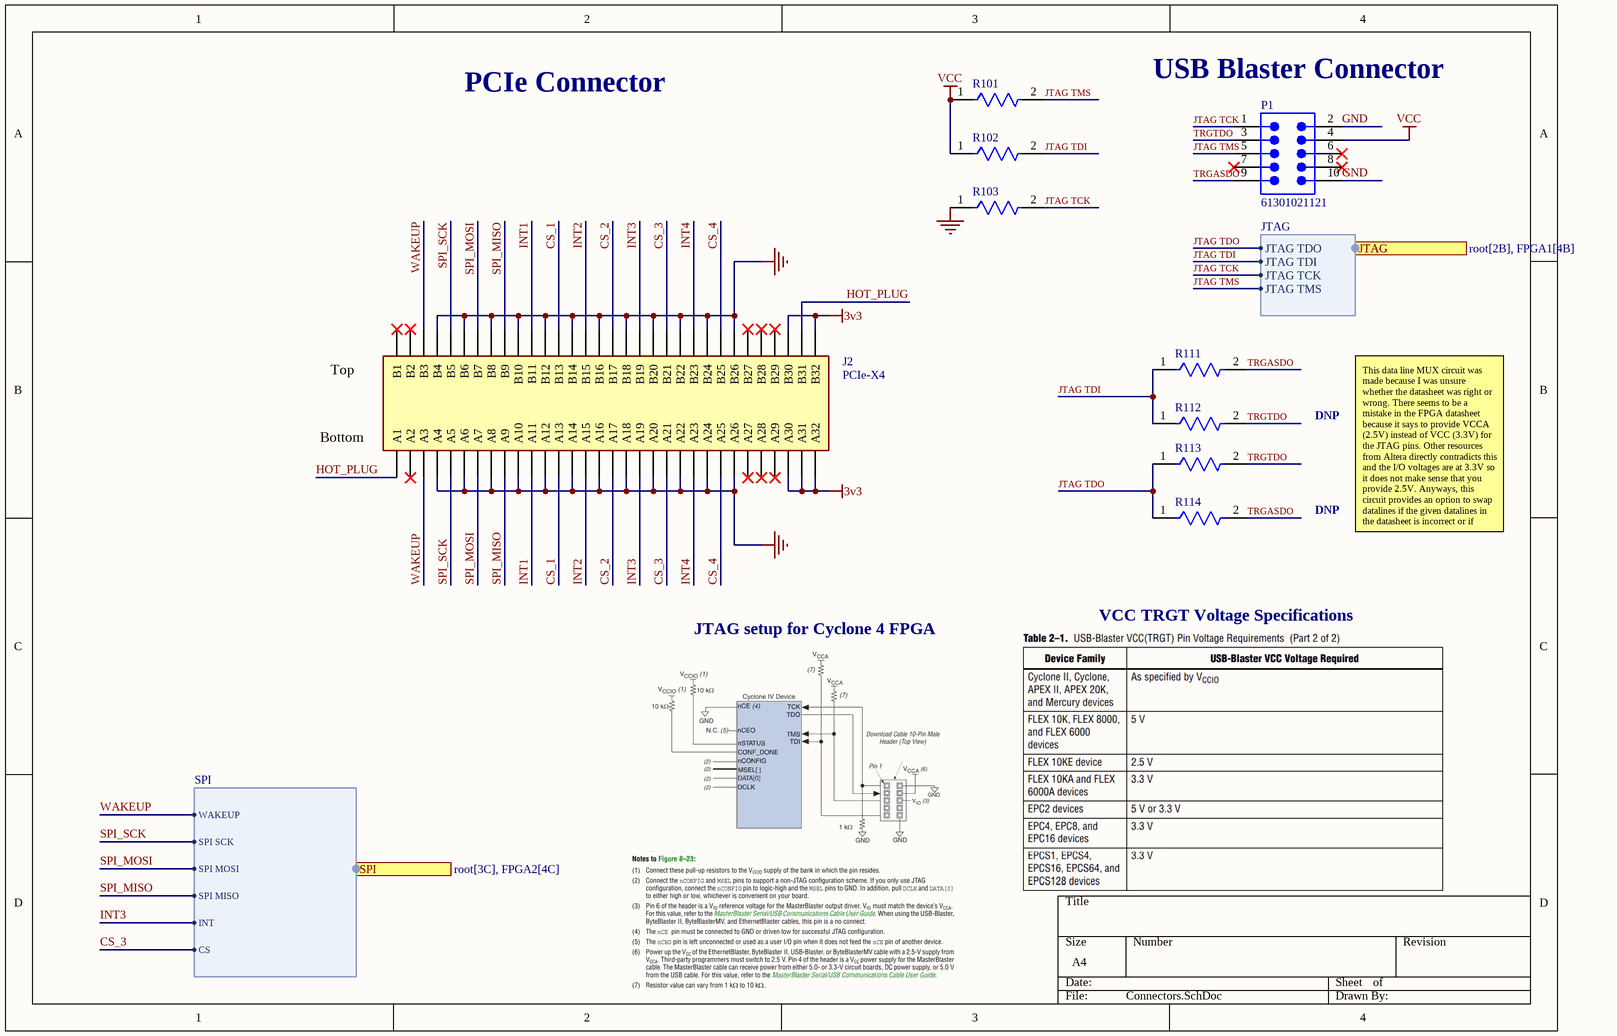
[diagram p4: Connectors.SchDoc]

### Parts
J2  PCIe-X4  [BUS_PCIexpress_x4]  (no BOM)
P1  61301021121  [61301021121]
R101  RC0402FR-071KL  [FP-RC0402-0_4-IPC_A]  (value not drawn)
R102  RC0402FR-071KL  [FP-RC0402-0_4-IPC_A]  (value not drawn)
R103  RC0402FR-071KL  [FP-RC0402-0_4-IPC_A]  (value not drawn)
R111  CRCW12060000ZSTA  [FP-CRCW1206-MFG]  (value not drawn)
R112  CRCW12060000ZSTA  [FP-CRCW1206-MFG]  (value not drawn)
R113  CRCW12060000ZSTA  [FP-CRCW1206-MFG]  (value not drawn)
R114  CRCW12060000ZSTA  [FP-CRCW1206-MFG]  (value not drawn)

### Ports
JTAG (harness JTAG, see root[2B], FPGA1[4B]), SPI (harness SPI, see root[3C], FPGA2[4C])

### Harnesses
JTAG: JTAG TDO, JTAG TDI, JTAG TCK, JTAG TMS
SPI: WAKEUP, SPI SCK, SPI MOSI, SPI MISO, INT, CS

### Nets
3v3: J2.A30 J2.A31 J2.A32 J2.B30 J2.B32
GND: J2.A4 J2.A6 J2.A8 J2.A10 J2.A12 J2.A14 J2.A16 J2.A18 J2.A20 J2.A22 J2.A24 J2.A26 J2.B4 J2.B6 J2.B8 J2.B10 J2.B12 J2.B14 J2.B16 J2.B18 J2.B20 J2.B22 J2.B24 J2.B26 P1.2 P1.10 R103.1
VCC: P1.4 R101.1 R102.1
CS_1: J2.A13 J2.B13
CS_2: J2.A17 J2.B17
CS_3: J2.A21 J2.B21 ; port SPI.CS
CS_4: J2.A25 J2.B25
HOT_PLUG: J2.A1 J2.B31
INT1: J2.A11 J2.B11
INT2: J2.A15 J2.B15
INT3: J2.A19 J2.B19 ; port SPI.INT
INT4: J2.A23 J2.B23
JTAG TCK: P1.1 R103.2 ; port JTAG.JTAG TCK
JTAG TDI: R102.2 R111.1 R112.1 ; port JTAG.JTAG TDI
JTAG TDO: R113.1 R114.1 ; port JTAG.JTAG TDO
JTAG TMS: P1.5 R101.2 ; port JTAG.JTAG TMS
SPI_MISO: J2.A9 J2.B9 ; port SPI.SPI MISO  [project net SPI MISO]
SPI_MOSI: J2.A7 J2.B7 ; port SPI.SPI MOSI  [project net SPI MOSI]
SPI_SCK: J2.A5 J2.B5 ; port SPI.SPI SCK  [project net SPI SCK]
TRGASDO: P1.9 R111.2 R114.2
TRGTDO: P1.3 R112.2 R113.2
WAKEUP: J2.A3 J2.B3 ; port SPI.WAKEUP

Not connected (* = marked no-connect by the designer): J2 A2* A27* A28* A29* B1* B2* B27* B28* B29*; P1 6* 7* 8*

### Notes on the sheet
- PCIe Connector
- (near P1) USB Blaster Connector
- (near J2) Top
- (near J2) Bottom
- DNP
- This data line MUX circuit was made because I was unsure whether the datasheet was right or wrong. There seems to be a mistake in the FPGA datasheet because it says to provide VCCA (2.5V) instead of VCC (3.3V) for the JTAG pins. Other resources from Altera directly contradicts this and the I/O voltages are at 3.3V so it does not make sense that you provide 2.5V. Anyways, this circuit provides an option to swap datalines if the given datalines in the datasheet is incorrect or if mistakes were made.
- JTAG setup for Cyclone 4 FPGA
- VCC TRGT Voltage Specifications

### Library data of the parts
P1 = CMP-1502-01084-4: THT Vertical Pin Header WR-PHD, Pitch 2.54 mm, Dual Row, 10 pins; Insulation Resistance: 1GΩ; Connector Type: Male Pin; Number of Contacts: 10; Pitch: 2.54mm; Contact Resistance: 20mΩ; Current Rating: 3A; Gender: Male; Insulation: Insulated; Voltage Rating: 250V; Mount: Through Hole; Orientation: Vertical; Max Operating Temperature: 105°C; Height: 8.89mm; Number of Pins: 10; Housing Material: PBT; Number of Positions: 10; Packaging: Bulk; RoHS: Compliant; Contact Mating Length: 5.9944mm; Lead Pitch: 2.54mm; Contact Gender: Male; Flammability Rating: UL94 V-0; Color: Black; Termination: Through Hole; Width: 12.7mm; Number of Rows: 2; Contact Material: Gold; Contact Plating: Gold; Operating Supply Voltage: 250V; Length: 12.7mm; Min Operating Temperature: -40°C; Row Spacing: 2.54mm
R101-R103 = CMP-2002-07472-3: RES 1K OHM 1% 1/16W 0402; Max Power Dissipation: 63mW; Resistance: 1kR; Voltage Rating (DC): 50V; Temperature Coefficient: 100ppm/°C; Power Rating: 62.5mW; Technology: THICK FILM; Size Code: 0402; Series: RC; Length: 1mm; Case/Package: 0402; Features: Moisture Resistant; Termination: SMD/SMT; Case Code (Metric): 1005; Reach SVHC Compliant: Yes; Number of Terminations: 2; Tolerance: 1%; Lead Free: Lead Free; Military Standard: Not; Resistor Type: Thick Film; Max Operating Temperature: 155°C; RoHS Compliant: Yes; Construction: Rectangular; Voltage Rating: 50V; Packaging: Tape and Reel; Height: 0.32mm; Number of Pins: 2; Resistance Tolerance: 1%; Case Code (Imperial): 0402; Depth: 0.5mm; Min Operating Temperature: -55°C; Width: 0.5mm
R111-R114 = CMP-00030-39388935-1: CRCW12060000ZSTA Zero Ohm Resistor, Jumper, 1206 [3216 Metric], Thick Film, 250 mW, Surface Mount; Voltage Rating (DC): 200V; Max Power Dissipation: 250mW; Temperature Coefficient: 100ppm/°C; Resistance: 0Ω; Packaging: Cut Tape; Lead Free: Contains Lead; Height: 609.6µm; Military Standard: Not; Min Operating Temperature: -55°C; Weight: 10.007382mg; Depth: 1.6mm; Termination: SMD/SMT; Mount: Surface Mount; RoHS: Compliant; Case Code (Metric): 3216; Max Operating Temperature: 155°C; NexarPartId: 39388935; Length: 3.2mm; Features: Automotive AEC-Q200; Case Code (Imperial): 1206; Composition: Thick Film; Case/Package: 1206; Voltage Rating: 200V; Width: 1.6mm; Contact Plating: Lead, Tin; Number of Terminations: 2; REACH SVHC: Unknown; Power Rating: 250mW; Radiation Hardening: No

## Sheet USB.SchDoc
size A4; SheetNumber: 7; SheetTotal: 9
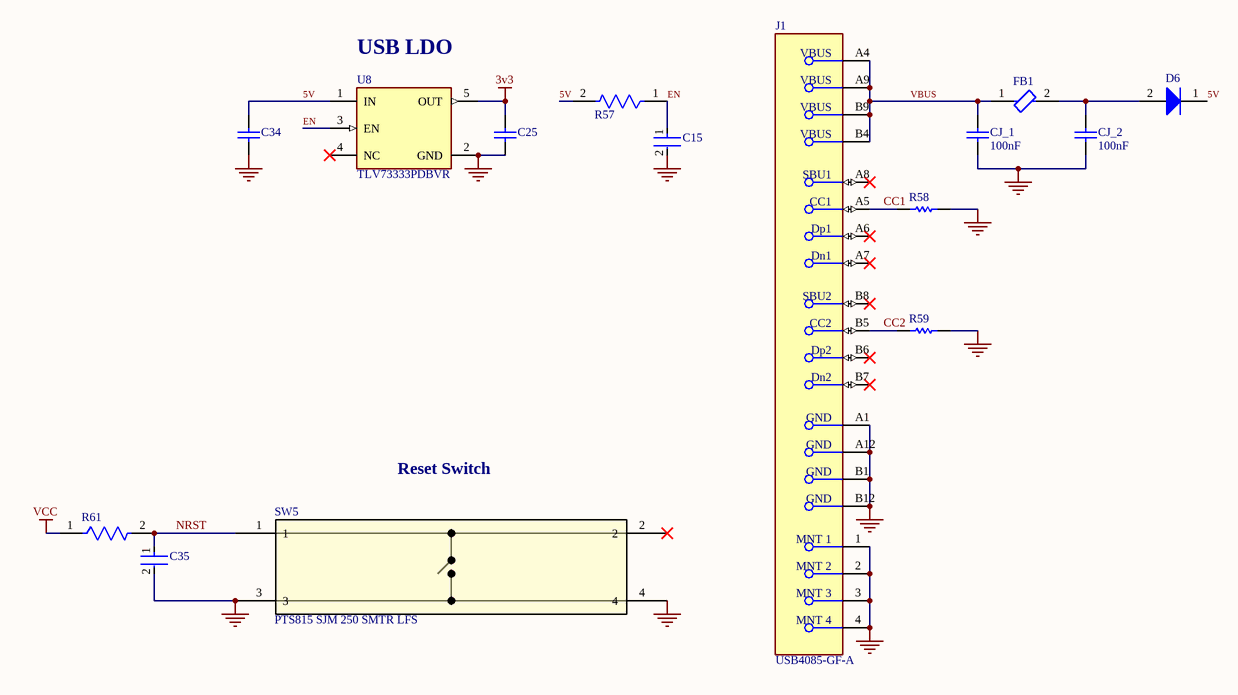
[diagram p5: USB.SchDoc]

### Parts
C15  CC0603KRX5R8BB105  [FP-CC0603-DA-MFG]  (value not drawn)
C25  C0603C105K9PACTU  [CAPC1608X90X35LL15T15]  (value not drawn)
C34  C0603C105K9PACTU  [CAPC1608X90X35LL15T15]  (value not drawn)
C35  CC0603KRX7R9BB104  [FP-CC0603-DA-MFG]  (value not drawn)
CJ_1  100nF  [CAPC1206(3216)170_L]
CJ_2  100nF  [CAPC1206(3216)170_L]
D6  NSR0320MW2T1G  [ONSC-SOD-323-2-477-02_V]  (value not drawn)
FB1  BLM18KG601SN1D  [FP-BLM18-0_15-t0_8-IPC_A]  (value not drawn)
J1  USB4085-GF-A  [FP-USB4085-GF-A-MFG]
R57  RC0603FR-0710KL  [FP-RC0603-0_55-IPC_C]  (value not drawn)
R58  RC0603FR-075K1L  [RESC1608X55X25ML10T15]  (value not drawn)
R59  RC0603FR-075K1L  [RESC1608X55X25ML10T15]  (value not drawn)
R61  AC0603JR-0747KL  [FP-AC0603-IPC_A]  (value not drawn)
SW5  PTS815 SJM 250 SMTR LFS  [SW4_PTS815 SJM 250 SMTR LFS_CNK]
U8  TLV73333PDBVR  [FP-DBV0005A-MFG]

### Nets
3v3: C25.2 U8.5(OUT)
GND: C15.2 C25.1 C34.1 C35.2 CJ_1.1 CJ_2.1 J1.1(MNT_1) J1.2(MNT_2) J1.3(MNT_3) J1.4(MNT_4) J1.A1(GND) J1.A12(GND) J1.B1(GND) J1.B12(GND) R58.2 R59.2 SW5.3 SW5.4 U8.2(GND)
VCC: R61.1
5V: C34.2 D6.1(K) R57.2 U8.1(IN)
CC1: J1.A5(CC1) R58.1
CC2: J1.B5(CC2) R59.1
EN: C15.1 R57.1 U8.3(EN)
NRST: C35.1 R61.2 SW5.1
VBUS: CJ_1.2 FB1.1 J1.A4(VBUS) J1.A9(VBUS) J1.B4(VBUS) J1.B9(VBUS)
NetCJ_2_2: CJ_2.2 D6.2(A) FB1.2

Not connected (* = marked no-connect by the designer): J1 A6(Dp1)* A7(Dn1)* A8(SBU1)* B6(Dp2)* B7(Dn2)* B8(SBU2)*; SW5 2*; U8 4(NC)*

### Notes on the sheet
- (near U8) USB LDO
- Reset Switch

### Library data of the parts
C15 = CMP-03422-000612-1: CAP CER 1UF 25V X5R 0603; Manufacturer: YAGEO; Description: CC0603 1 uF X5R 10.00% 25 V; Material: Ceramic; Tolerance: 0.1; Temperature Coefficient: 15%; Automotive: No; Octopart: https://octopart.com/cc0603krx5r8bb105-yageo-9292811; Package: CC0603-DA; Temperature Range High: +125°C; Digikey Description: CAP CER 1UF 25V X5R 0603; Mouser Description: Multilayer Ceramic Capacitors MLCC - SMD/SMT 1.0uF 25V X5R 10%; Device Class L2: Capacitors; Category: Cap; Value: 1 uF; Temperature: -55°C to +125°C; ComponentLink2URL: http://www.yageo.com/documents/recent/UPY-GPHC_X7R_6.3V-to-50V_18.pdf; Capacitance: 1 uF; ComponentLink2Description: Datasheet; Voltage: 25 V; Manufacturer Part Number: CC0603KRX5R8BB105; Height: 0.9mm; Device Class L3: Ceramic Capacitors; Temperature Characteristic: X5R; Footprint Url: http://www.yageo.com/exep/pages/download/literatures/UPY-C_GEN_24.pdf; Temperature Range Low: -55°C; Device Class L1: Passive Components; Voltage Rating: 25 V; Lead Free: Yes; RoHS: TRUE
C25 C34 = CMP-2006-02241-1: Manufacturer: Kemet; Part Number: C0603C105K9PACTU
C35 = CMP-2100-03601-2: CAP CER 0.1UF 50V X7R 0603; Manufacturer: YAGEO; Material: Ceramic; Capacitance: 100 nF; Temperature Coefficient: 15%; Tolerance: 0.1; Value: 100 nF; Description: CC0603 100 nF X7R 10.00% 50 V; Height: 0.9mm; Voltage: 50 V; ComponentLink2Description: Datasheet; Device Class L2: Capacitors; Temperature Range High: +125°C; Category: Cap; Footprint Url: http://www.yageo.com/exep/pages/download/literatures/UPY-C_GEN_24.pdf; ComponentLink2URL: http://www.yageo.com/documents/recent/UPY-GPHC_X7R_6.3V-to-50V_18.pdf; Package: CC0603-DA; Temperature: -55°C to +125°C; Voltage Rating: 50 V; Temperature Characteristic: X7R; Device Class L1: Passive Components; Temperature Range Low: -55°C; Manufacturer Part Number: CC0603KRX7R9BB104; RoHS: TRUE; Automotive: No; Device Class L3: Ceramic Capacitors; Octopart: https://octopart.com/cc0603krx7r9bb104-yageo-42244635; Mouser Description: Multilayer Ceramic Capacitor, CC Series, 0.1 - F, - 10%, X7R, 50 V, 0603 [1608 Metric]; Lead Free: Yes; Digikey Description: CAP CER 0.1UF 50V X7R 0603
CJ_1 CJ_2 = CMP-1037-04188-1: CAP 100nF 25V ±5% 1206 (3216 Metric) Thickness 1.7mm SMD; Case-Metric: 3216; Case-EIA: 1206; Tolerance: Â±5%; Max Thickness: 1.7 mm; Value: 100nF; Technology: SMT; Rated Voltage: 25 V
D6 = CMP-1055-00466-1: Schottky Barrier Diode, 2-Pin SOD-323, Pb-Free, Tape and Reel; Manufacturer: On Semiconductor; Configuration: Single; IFSM Max (A): 5; Mounting Technology: Surface Mount; Packing: Tape and Reel; PackageDescription: 2-Pin SOD, Body 1.7 x 1.25 mm; ComponentLink3Description: Package Specification; PartNumber: NSR0320MW2T1G; ComponentLink1URL: http://www.onsemi.com/; PackageReference: SOD-323-2-477-02; RoHS: TRUE; PackageVersion: Rev. H, 03/2007; DatasheetVersion: Rev. 4; ComponentLink1Description: Manufacturer URL; ComponentLink3URL: http://www.onsemi.com/pub_link/Collateral/477-02.PDF.1; ComponentLink2Description: Datasheet; ComponentLink2URL: http://www.onsemi.cn/pub_link/Collateral/NSR0320MW2T1-D.PDF
FB1 = CMP-0686-00581-3: Chip Ferrite Bead, 0603, 600Ω @ 100MHz, 0.15Ω, 25%, 1.3A; Material: Steel; Number of Lines: 1; Impedance: 600R; DC Resistance (DCR): 150mR; Tolerance: 25%; Case Code (Metric): 1608; Width: 0.8mm; DC Current: 1.3A; Max DC Current: 1.3A; Package Quantity: 1; Number of Pins: 2; Military Standard: Not; RoHS Compliant: Yes; Termination: SMD/SMT; Max Operating Temperature: 125°C; Length: 1.6mm; Depth: 0.8mm; Case Code (Imperial): 0603; Series: BLM18K; Inductor Type: FERRITE BEAD; Core Material: Ferrite; Number of Circuits: 1; Height: 0.8mm; Case/Package: 0603; REACH SVHC: No SVHC; Packaging: Tape and Reel; Min Operating Temperature: -55°C; Max Current Rating: 1.3A; Radiation Hardening: No; Current Rating: 1.3A; Lead Free: Lead Free; Test Frequency: 100MHz; Weight: 7.1E-05oz
J1 = CMP-196119-000001-2: CONN RCPT USB2.0 TYPE C 24POS RA; Gender: Receptacle; Number of Positions: 16; USB Standard: USB 2.0; Orientation: Right Angle; Contact Plating: Gold; Contact Material: Copper Alloy
R57 = CMP-2100-03664-2: RES 10K OHM 1% 1/10W 0603; Voltage Rating: 75V; Voltage Rating (DC): 50V; Resistance: 10kR; Power Rating: 100mW; Temperature Coefficient: 100ppm/°C; Depth: 0.8mm; Termination: SMD/SMT; Resistor Type: Thick Film; Series: RC; Construction: Rectangular; Features: Moisture Resistant; Packaging: Tape and Reel; Min Operating Temperature: -55°C; Number of Terminations: 2; Lead Pitch: 0.3mm; RoHS Compliant: Yes; Case/Package: 0603; Resistance Tolerance: 1%; Military Standard: Not; Weight: 7.1E-05oz; Number of Pins: 2; Tolerance: 1%; Length: 1.6mm; Case Code (Imperial): 0603; Lead Free: Lead Free; Width: 0.8mm; Max Power Dissipation: 100mW; Height: 0.45mm; Max Operating Temperature: 155°C; Case Code (Metric): 1608; Size Code: 0603
R58 R59 = CMP-2000-04091-1: Manufacturer: Yageo; Part Number: RC0603FR-075K1L
R61 = CMP-03412-049221-1: RES 47kΩ 5.00% 0.1W 0603; Resistance: 47kR; Tolerance: 5%; Temperature Coefficient: 100ppm/°C; Max Power Dissipation: 100mW; Voltage Rating: 50V; Packaging: Tape and Reel; Series: AC; Ratings: AEC-Q200; Case Code (Metric): 1608; Case Code (Imperial): 0603; Resistor Type: Thick Film; Max Operating Temperature: 155°C; Case/Package: 0603; Features: Moisture Resistant; Height: 0.45mm; Termination: SMD/SMT; Length: 1.6mm; Min Operating Temperature: -55°C; Number of Terminations: 2; Width: 0.8mm; RoHS Compliant: Yes; Power Rating: 100mW
SW5 = PTS815 SJM 250 SMTR LFS: No Description Available; Manufacturer_Name: C&K Components; Copyright: Copyright (C) 2026 Ultra Librarian. All rights reserved.; Manufacturer_Part_Number: PTS815 SJM 250 SMTR LFS; RefDes: RefDes; Type: Type
U8 = CMP-04917-000053-1: IC REG LINEAR 3.3V 300MA SOT23-5; Manufacturer: Texas Instruments; Max Junction Temp: +125°C; Accuracy Percentage: 1%; Min Supply Voltage: 1.4V; Number Of Outputs: 1; Dropout Voltage: 125mV; Nominal Supply Current: 34uA; Max Supply Voltage: 5.5V; Output Type: Fixed; Standoff Height: 0mm; Digikey Description: IC REG LINEAR 3.3V 300MA SOT23-5; Manufacturer Part Number: TLV73333PDBVR; Temperature Range High: +125°C; Temperature: -40°C to +125°C; Output Current: 300mA; Mouser Description: LDO Voltage Regulators Capacitr-Free 300-mA 5-SOT-23 -40 to 125; Automotive: No; Height: 1.45mm; Device Class L3: Voltage Regulators - Linear; ComponentLink2Description: Datasheet; Device Class L1: Integrated Circuits (ICs); ComponentLink2URL: http://www.ti.com/lit/ds/symlink/tlv733p.pdf; Octopart: https://octopart.com/tlv73333pdbvr-texas+instruments-51080890; Temperature Range Low: -40°C; RoHS: TRUE; Lead Free: Yes; Output Voltage: 3.3V; Package: DBV0005A; Device Class L2: Power Management ICs; Category: IC